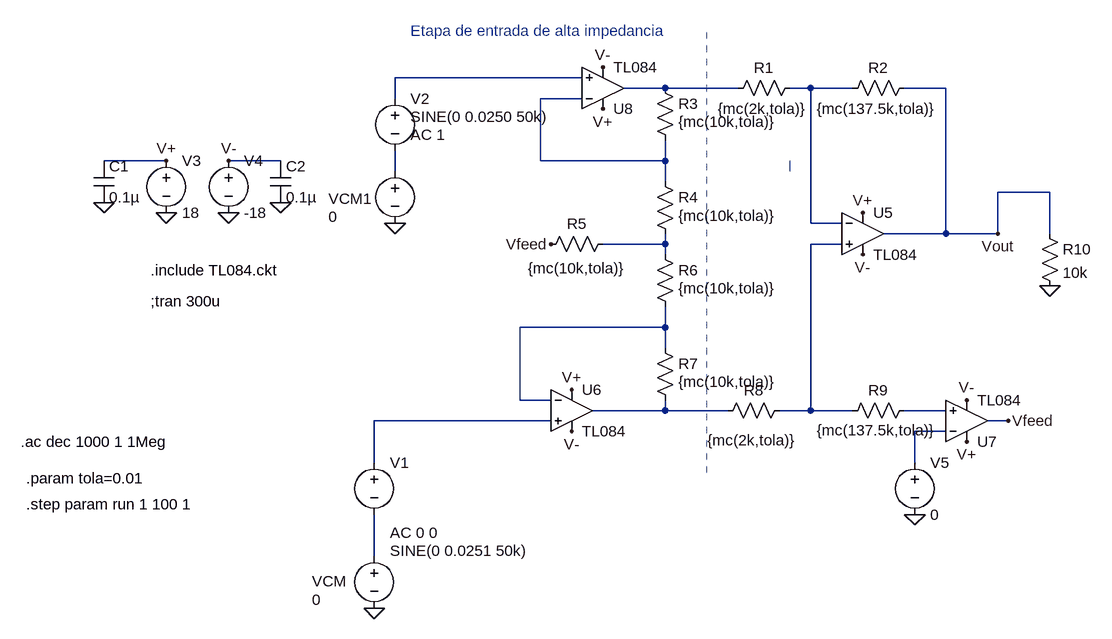
[diagram p0: schematic ModoDiferencialMontecarlo.asc]
ModoDiferencialMontecarlo.asc, the LTspice schematic file:
Version 4
SHEET 1 1008 680
WIRE 48 -160 -240 -160
WIRE 176 -144 112 -144
WIRE 288 -144 176 -144
WIRE 400 -144 368 -144
WIRE 464 -144 400 -144
WIRE 608 -144 544 -144
WIRE -240 -128 -240 -160
WIRE 48 -128 -16 -128
WIRE -592 -32 -688 -32
WIRE -416 -32 -496 -32
WIRE -16 -32 -16 -128
WIRE 176 -32 176 -64
WIRE 176 -32 -16 -32
WIRE -240 -16 -240 -48
WIRE 176 0 176 -32
WIRE 768 16 688 16
WIRE 400 64 400 -144
WIRE 448 64 400 64
WIRE 608 80 608 -144
WIRE 608 80 512 80
WIRE 688 80 688 16
WIRE 688 80 608 80
WIRE 768 80 768 16
WIRE 176 96 176 80
WIRE 176 96 80 96
WIRE 448 96 400 96
WIRE 176 112 176 96
WIRE 176 224 176 192
WIRE 176 224 -48 224
WIRE 176 256 176 224
WIRE -48 336 -48 224
WIRE 0 336 -48 336
WIRE 176 352 176 336
WIRE 176 352 64 352
WIRE 272 352 176 352
WIRE 400 352 400 96
WIRE 400 352 352 352
WIRE 464 352 400 352
WIRE 608 352 544 352
WIRE 0 368 -272 368
WIRE 704 368 672 368
WIRE 608 384 560 384
WIRE -272 432 -272 368
WIRE 560 432 560 384
WIRE -272 576 -272 512
FLAG 704 368 Vfeed
FLAG 0 96 Vfeed
FLAG -272 656 0
FLAG -240 64 0
FLAG 688 80 Vout
FLAG -496 48 0
FLAG -592 48 0
FLAG -592 -32 V+
FLAG 80 -112 V+
FLAG 480 48 V+
FLAG 640 400 V+
FLAG 32 320 V+
FLAG -496 -32 V-
FLAG 80 -176 V-
FLAG 480 112 V-
FLAG 640 336 V-
FLAG 32 384 V-
FLAG 560 512 0
FLAG -416 32 0
FLAG -688 32 0
FLAG 768 160 0
SYMBOL res 160 -16 R0
WINDOW 3 36 68 Left 2
SYMATTR Value {mc(10k,tola)}
SYMATTR InstName R4
SYMATTR SpiceLine tol=0
SYMBOL res 160 96 R0
WINDOW 3 36 68 Left 2
SYMATTR Value {mc(10k,tola)}
SYMATTR InstName R6
SYMATTR SpiceLine tol=00
SYMBOL res 160 240 R0
WINDOW 3 36 68 Left 2
SYMATTR Value {mc(10k,tola)}
SYMATTR InstName R7
SYMATTR SpiceLine tol=0
SYMBOL res 160 -160 R0
WINDOW 3 36 68 Left 2
SYMATTR Value {mc(10k,tola)}
SYMATTR InstName R3
SYMBOL res 384 -160 R90
WINDOW 0 0 56 VBottom 2
WINDOW 3 63 59 VBottom 2
SYMATTR InstName R1
SYMATTR Value {mc(2k,tola)}
SYMBOL res 560 -160 R90
WINDOW 0 0 56 VBottom 2
WINDOW 3 63 59 VBottom 2
SYMATTR InstName R2
SYMATTR Value {mc(137.5k,tola)}
SYMBOL res 368 336 R90
WINDOW 0 0 56 VBottom 2
WINDOW 3 77 59 VBottom 2
SYMATTR InstName R8
SYMATTR Value {mc(2k,tola)}
SYMBOL res 96 80 R90
WINDOW 0 0 56 VBottom 2
WINDOW 3 69 56 VBottom 2
SYMATTR InstName R5
SYMATTR Value {mc(10k,tola)}
SYMATTR SpiceLine tol=1
SYMBOL res 560 336 R90
WINDOW 0 0 56 VBottom 2
WINDOW 3 62 59 VBottom 2
SYMATTR InstName R9
SYMATTR Value {mc(137.5k,tola)}
SYMBOL voltage -240 -32 R0
WINDOW 0 -102 58 Left 2
WINDOW 123 0 0 Left 0
WINDOW 39 0 0 Left 0
WINDOW 3 -102 86 Left 2
SYMATTR InstName VCM1
SYMATTR Value 0
SYMBOL voltage -272 560 R0
WINDOW 0 -96 55 Left 2
WINDOW 123 0 0 Left 0
WINDOW 39 0 0 Left 0
WINDOW 3 -96 83 Left 2
SYMATTR InstName VCM
SYMATTR Value 0
SYMBOL Opamps\\opamp2 480 16 R0
SYMATTR InstName U5
SYMATTR Value TL084
SYMBOL Opamps\\opamp2 32 288 R0
SYMATTR InstName U6
SYMATTR Value TL084
SYMBOL Opamps\\opamp2 640 432 M180
SYMATTR InstName U7
SYMATTR Value TL084
SYMBOL Opamps\\opamp2 80 -80 M180
SYMATTR InstName U8
SYMATTR Value TL084
SYMBOL voltage -592 -48 R0
WINDOW 123 0 0 Left 0
WINDOW 39 0 0 Left 0
SYMATTR InstName V3
SYMATTR Value 18
SYMBOL voltage -496 -48 R0
WINDOW 123 0 0 Left 0
WINDOW 39 0 0 Left 0
SYMATTR InstName V4
SYMATTR Value -18
SYMBOL voltage -272 416 R0
WINDOW 3 24 152 Left 2
WINDOW 123 24 124 Left 2
WINDOW 39 0 0 Left 0
SYMATTR Value SINE(0 0.0251 50k)
SYMATTR Value2 AC 0 0
SYMATTR InstName V1
SYMBOL voltage -240 -144 R0
WINDOW 3 24 44 Left 2
WINDOW 123 24 72 Left 2
WINDOW 39 0 0 Left 0
SYMATTR Value SINE(0 0.0250 50k)
SYMATTR Value2 AC 1
SYMATTR InstName V2
SYMBOL voltage 560 416 R0
WINDOW 123 0 0 Left 0
WINDOW 39 0 0 Left 0
SYMATTR InstName V5
SYMATTR Value 0
SYMBOL cap -704 -32 R0
SYMATTR InstName C1
SYMATTR Value 0.1µ
SYMBOL cap -432 -32 R0
SYMATTR InstName C2
SYMATTR Value 0.1µ
SYMBOL res 752 64 R0
SYMATTR InstName R10
SYMATTR Value 10k
TEXT -616 136 Left 2 !.include TL084.ckt
TEXT -616 184 Left 2 !;tran 300u
TEXT -216 -232 Left 2 ;Etapa de entrada de alta impedancia
TEXT -816 400 Left 2 !.ac dec 1000 1 1Meg
TEXT -808 456 Left 2 !.param tola=0.01
TEXT -808 496 Left 2 !.step param run 1 100 1
LINE Normal 240 448 240 -240 1
CIRCLE Normal 368 -16 368 -32 1

The netlist it stands for:
* ModoDiferencialMontecarlo.asc
R4 N004 N006 {mc(10k,tola)} tol=0
R6 N006 N008 {mc(10k,tola)} tol=00
R7 N008 N009 {mc(10k,tola)} tol=0
R3 N002 N004 {mc(10k,tola)}
R1 N003 N002 {mc(2k,tola)}
R2 Vout N003 {mc(137.5k,tola)}
R8 N007 N009 {mc(2k,tola)}
R5 N006 Vfeed {mc(10k,tola)} tol=1
R9 N010 N007 {mc(137.5k,tola)}
VCM1 N005 0 0
VCM N013 0 0
XU5 N007 N003 V+ V- Vout TL084  ; pins In+ In- V+ V- OUT
XU6 N011 N008 V+ V- N009 TL084  ; pins In+ In- V+ V- OUT
XU7 N010 N012 V+ V- Vfeed TL084  ; pins In+ In- V+ V- OUT
XU8 N001 N004 V+ V- N002 TL084  ; pins In+ In- V+ V- OUT
V3 V+ 0 18
V4 V- 0 -18
V1 N011 N013 SINE(0 0.0251 50k) AC 0 0
V2 N001 N005 SINE(0 0.0250 50k) AC 1
V5 N012 0 0
C1 V+ 0 0.1µ
C2 V- 0 0.1µ
R10 Vout 0 10k
.include TL084.ckt
;tran 300u
* Etapa de entrada de alta impedancia
.ac dec 1000 1 1Meg
.param tola=0.01
.step param run 1 100 1
.backanno
.end